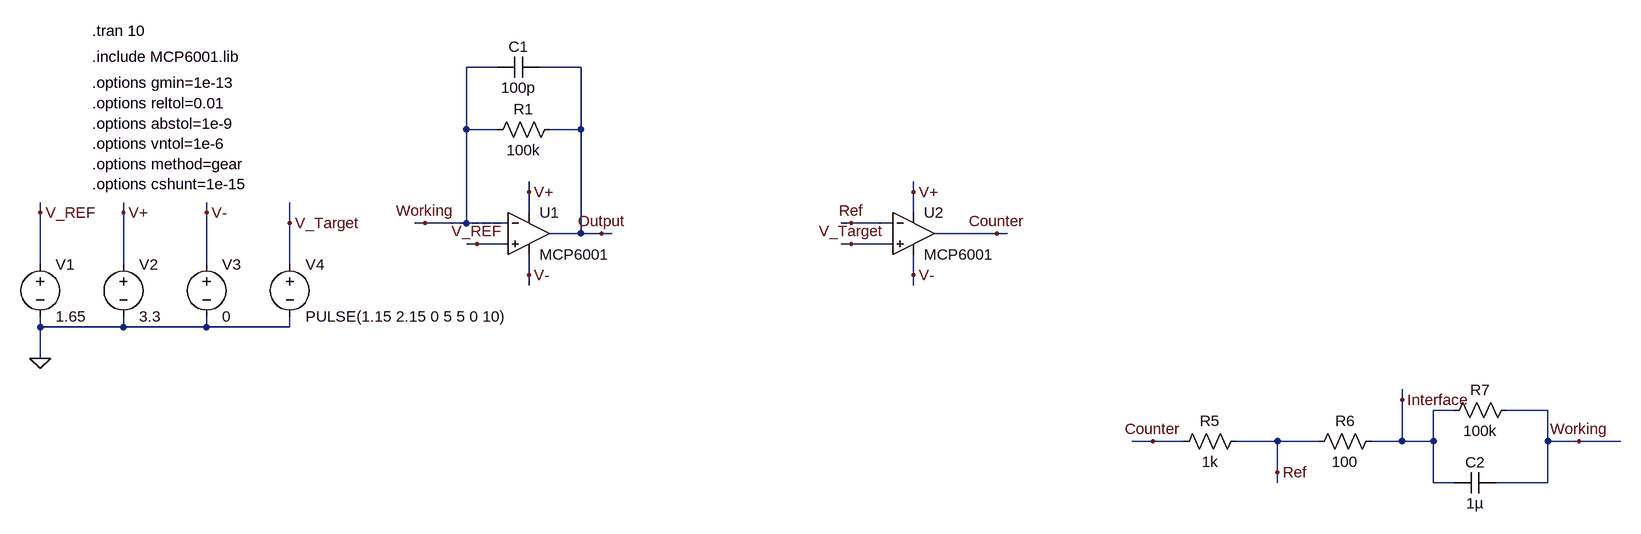
[diagram p0: schematic Control Loop.asc]
Control Loop.asc, the LTspice schematic file:
Version 4.1
SHEET 1 1796 916
WIRE 64 -48 16 -48
WIRE 192 -48 128 -48
WIRE 16 48 16 -48
WIRE 64 48 16 48
WIRE 192 48 192 -48
WIRE 192 48 144 48
WIRE 112 144 112 128
WIRE 704 144 704 128
WIRE -640 176 -640 160
WIRE -512 176 -512 160
WIRE -384 176 -384 160
WIRE 112 176 112 144
WIRE 704 176 704 144
WIRE -256 192 -256 160
WIRE -48 192 -64 192
WIRE 16 192 16 48
WIRE 16 192 -48 192
WIRE 80 192 16 192
WIRE 608 192 592 192
WIRE 672 192 608 192
WIRE 192 208 192 48
WIRE 192 208 144 208
WIRE 224 208 192 208
WIRE 240 208 224 208
WIRE 832 208 736 208
WIRE 848 208 832 208
WIRE 32 224 16 224
WIRE 80 224 32 224
WIRE 608 224 592 224
WIRE 672 224 608 224
WIRE -640 256 -640 176
WIRE -512 256 -512 176
WIRE -384 256 -384 176
WIRE -256 256 -256 192
WIRE 112 272 112 240
WIRE 704 272 704 240
WIRE 112 288 112 272
WIRE 704 288 704 272
WIRE -640 352 -640 336
WIRE -512 352 -512 336
WIRE -512 352 -640 352
WIRE -384 352 -384 336
WIRE -384 352 -512 352
WIRE -256 352 -256 336
WIRE -256 352 -384 352
WIRE -640 400 -640 352
WIRE 1456 464 1456 448
WIRE 1536 480 1504 480
WIRE 1680 480 1616 480
WIRE 1072 528 1040 528
WIRE 1120 528 1072 528
WIRE 1264 528 1200 528
WIRE 1328 528 1264 528
WIRE 1456 528 1456 464
WIRE 1456 528 1408 528
WIRE 1504 528 1504 480
WIRE 1504 528 1456 528
WIRE 1680 528 1680 480
WIRE 1728 528 1680 528
WIRE 1792 528 1728 528
WIRE 1264 576 1264 528
WIRE 1264 592 1264 576
WIRE 1504 592 1504 528
WIRE 1536 592 1504 592
WIRE 1680 592 1680 528
WIRE 1680 592 1600 592
FLAG 32 224 V_REF
FLAG -640 176 V_REF
FLAG 224 208 Output
FLAG 112 144 V+
FLAG -512 176 V+
FLAG 112 272 V-
FLAG -384 176 V-
FLAG 704 144 V+
FLAG 704 272 V-
FLAG 608 224 V_Target
FLAG 608 192 Ref
FLAG 832 208 Counter
FLAG -640 400 0
FLAG -48 192 Working
FLAG -256 192 V_Target
FLAG 1264 576 Ref
FLAG 1456 464 Interface
FLAG 1072 528 Counter
FLAG 1728 528 Working
SYMBOL res 160 32 R90
WINDOW 0 0 56 VBottom 2
WINDOW 3 32 56 VTop 2
SYMATTR InstName R1
SYMATTR Value 100k
SYMBOL cap 128 -64 R90
WINDOW 0 0 32 VBottom 2
WINDOW 3 32 32 VTop 2
SYMATTR InstName C1
SYMATTR Value 100p
SYMBOL voltage -640 240 R0
WINDOW 123 0 0 Left 0
WINDOW 39 0 0 Left 0
SYMATTR InstName V1
SYMATTR Value 1.65
SYMBOL voltage -512 240 R0
WINDOW 123 0 0 Left 0
WINDOW 39 0 0 Left 0
SYMATTR InstName V2
SYMATTR Value 3.3
SYMBOL voltage -384 240 R0
WINDOW 123 0 0 Left 0
WINDOW 39 0 0 Left 0
SYMATTR InstName V3
SYMATTR Value 0
SYMBOL voltage -256 240 R0
WINDOW 123 0 0 Left 0
WINDOW 39 0 0 Left 0
SYMATTR InstName V4
SYMATTR Value PULSE(1.15 2.15 0 5 5 0 10)
SYMBOL OpAmps\\opamp2 112 144 R0
SYMATTR InstName U1
SYMATTR Value MCP6001
SYMBOL OpAmps\\opamp2 704 144 R0
SYMATTR InstName U2
SYMATTR Value MCP6001
SYMBOL res 1216 512 R90
WINDOW 0 0 56 VBottom 2
WINDOW 3 32 56 VTop 2
SYMATTR InstName R5
SYMATTR Value 1k
SYMBOL res 1424 512 R90
WINDOW 0 0 56 VBottom 2
WINDOW 3 32 56 VTop 2
SYMATTR InstName R6
SYMATTR Value 100
SYMBOL res 1632 464 R90
WINDOW 0 0 56 VBottom 2
WINDOW 3 32 56 VTop 2
SYMATTR InstName R7
SYMATTR Value 100k
SYMBOL cap 1600 576 R90
WINDOW 0 0 32 VBottom 2
WINDOW 3 32 32 VTop 2
SYMATTR InstName C2
SYMATTR Value 1µ
TEXT -560 -104 Left 2 !.tran 10
TEXT -560 -64 Left 2 !.include MCP6001.lib
TEXT -560 -24 Left 2 !.options gmin=1e-13\n.options reltol=0.01\n.options abstol=1e-9\n.options vntol=1e-6\n.options method=gear\n.options cshunt=1e-15

The netlist it stands for:
* Control Loop.asc
R1 Output Working 100k
C1 Output Working 100p
V1 V_REF 0 1.65
V2 V+ 0 3.3
V3 V- 0 0
V4 V_Target 0 PULSE(1.15 2.15 0 5 5 0 10)
X§U1 V_REF Working V+ V- Output MCP6001  ; pins In+ In- V+ V- OUT
X§U2 V_Target Ref V+ V- Counter MCP6001  ; pins In+ In- V+ V- OUT
R5 Ref Counter 1k
R6 Interface Ref 100
R7 Working Interface 100k
C2 Working Interface 1µ
.tran 10
.include MCP6001.lib
.options gmin=1e-13
.options reltol=0.01
.options abstol=1e-9
.options vntol=1e-6
.options method=gear
.options cshunt=1e-15
.backanno
.end

* Results of the author's LTspice run, read from the files saved beside the schematic
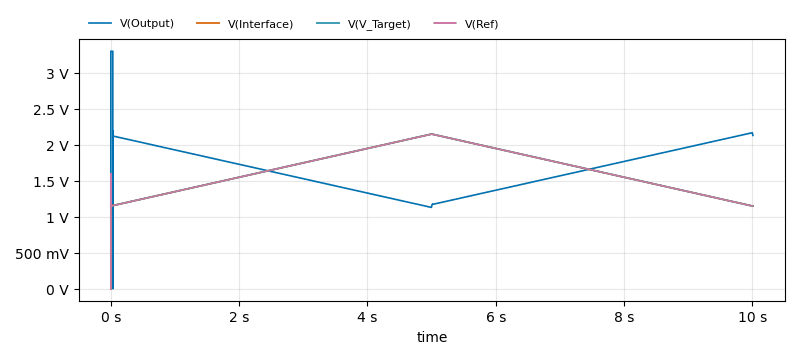
[diagram p1: Transient Analysis of Control Loop.asc, plotted from the saved traces]
* Transient Analysis, 1 run:
*   V(Output): min 0 V, max 3.3 V, average 1.653 V, rms 1.687 V, last 2.13 V
*   V(Interface): min 0 V, max 2.148 V, average 1.649 V, rms 1.68 V, last 1.151 V
*   V(V_Target): min 1.15 V, max 2.149 V, average 1.65 V, rms 1.681 V, last 1.151 V
*   V(Ref): min 0 V, max 2.149 V, average 1.649 V, rms 1.68 V, last 1.151 V